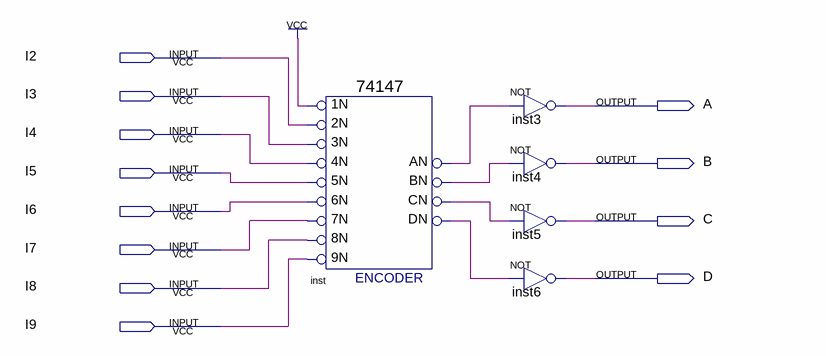
[diagram p0: schematic sheet]
// Quartus schematic ten_line_to_four_line_BCD_priority_encoder.bdf as structural Verilog: 5 symbols, 12 pins
module ten_line_to_four_line_BCD_priority_encoder (
  input  I2,
  input  I3,
  input  I4,
  input  I5,
  input  I6,
  input  I7,
  input  I8,
  input  I9,
  output A,
  output B,
  output C,
  output D
);

  wire inst_an, inst_bn, inst_cn, inst_dn;

  \74147  inst (
    .\1N (1'b1), .\2N (I2), .\3N (I3), .\6N (I6), .\5N (I5), .\4N (I4), .\9N (I9), .\8N (I8), .\7N (I7),
    .CN(inst_cn), .BN(inst_bn), .AN(inst_an), .DN(inst_dn));
  not inst3 (A, inst_an);
  not inst4 (B, inst_bn);
  not inst5 (C, inst_cn);
  not inst6 (D, inst_dn);
endmodule
